# EAGLE design Meter-Daughterboard-input-v43JR (EAGLE 5.11)
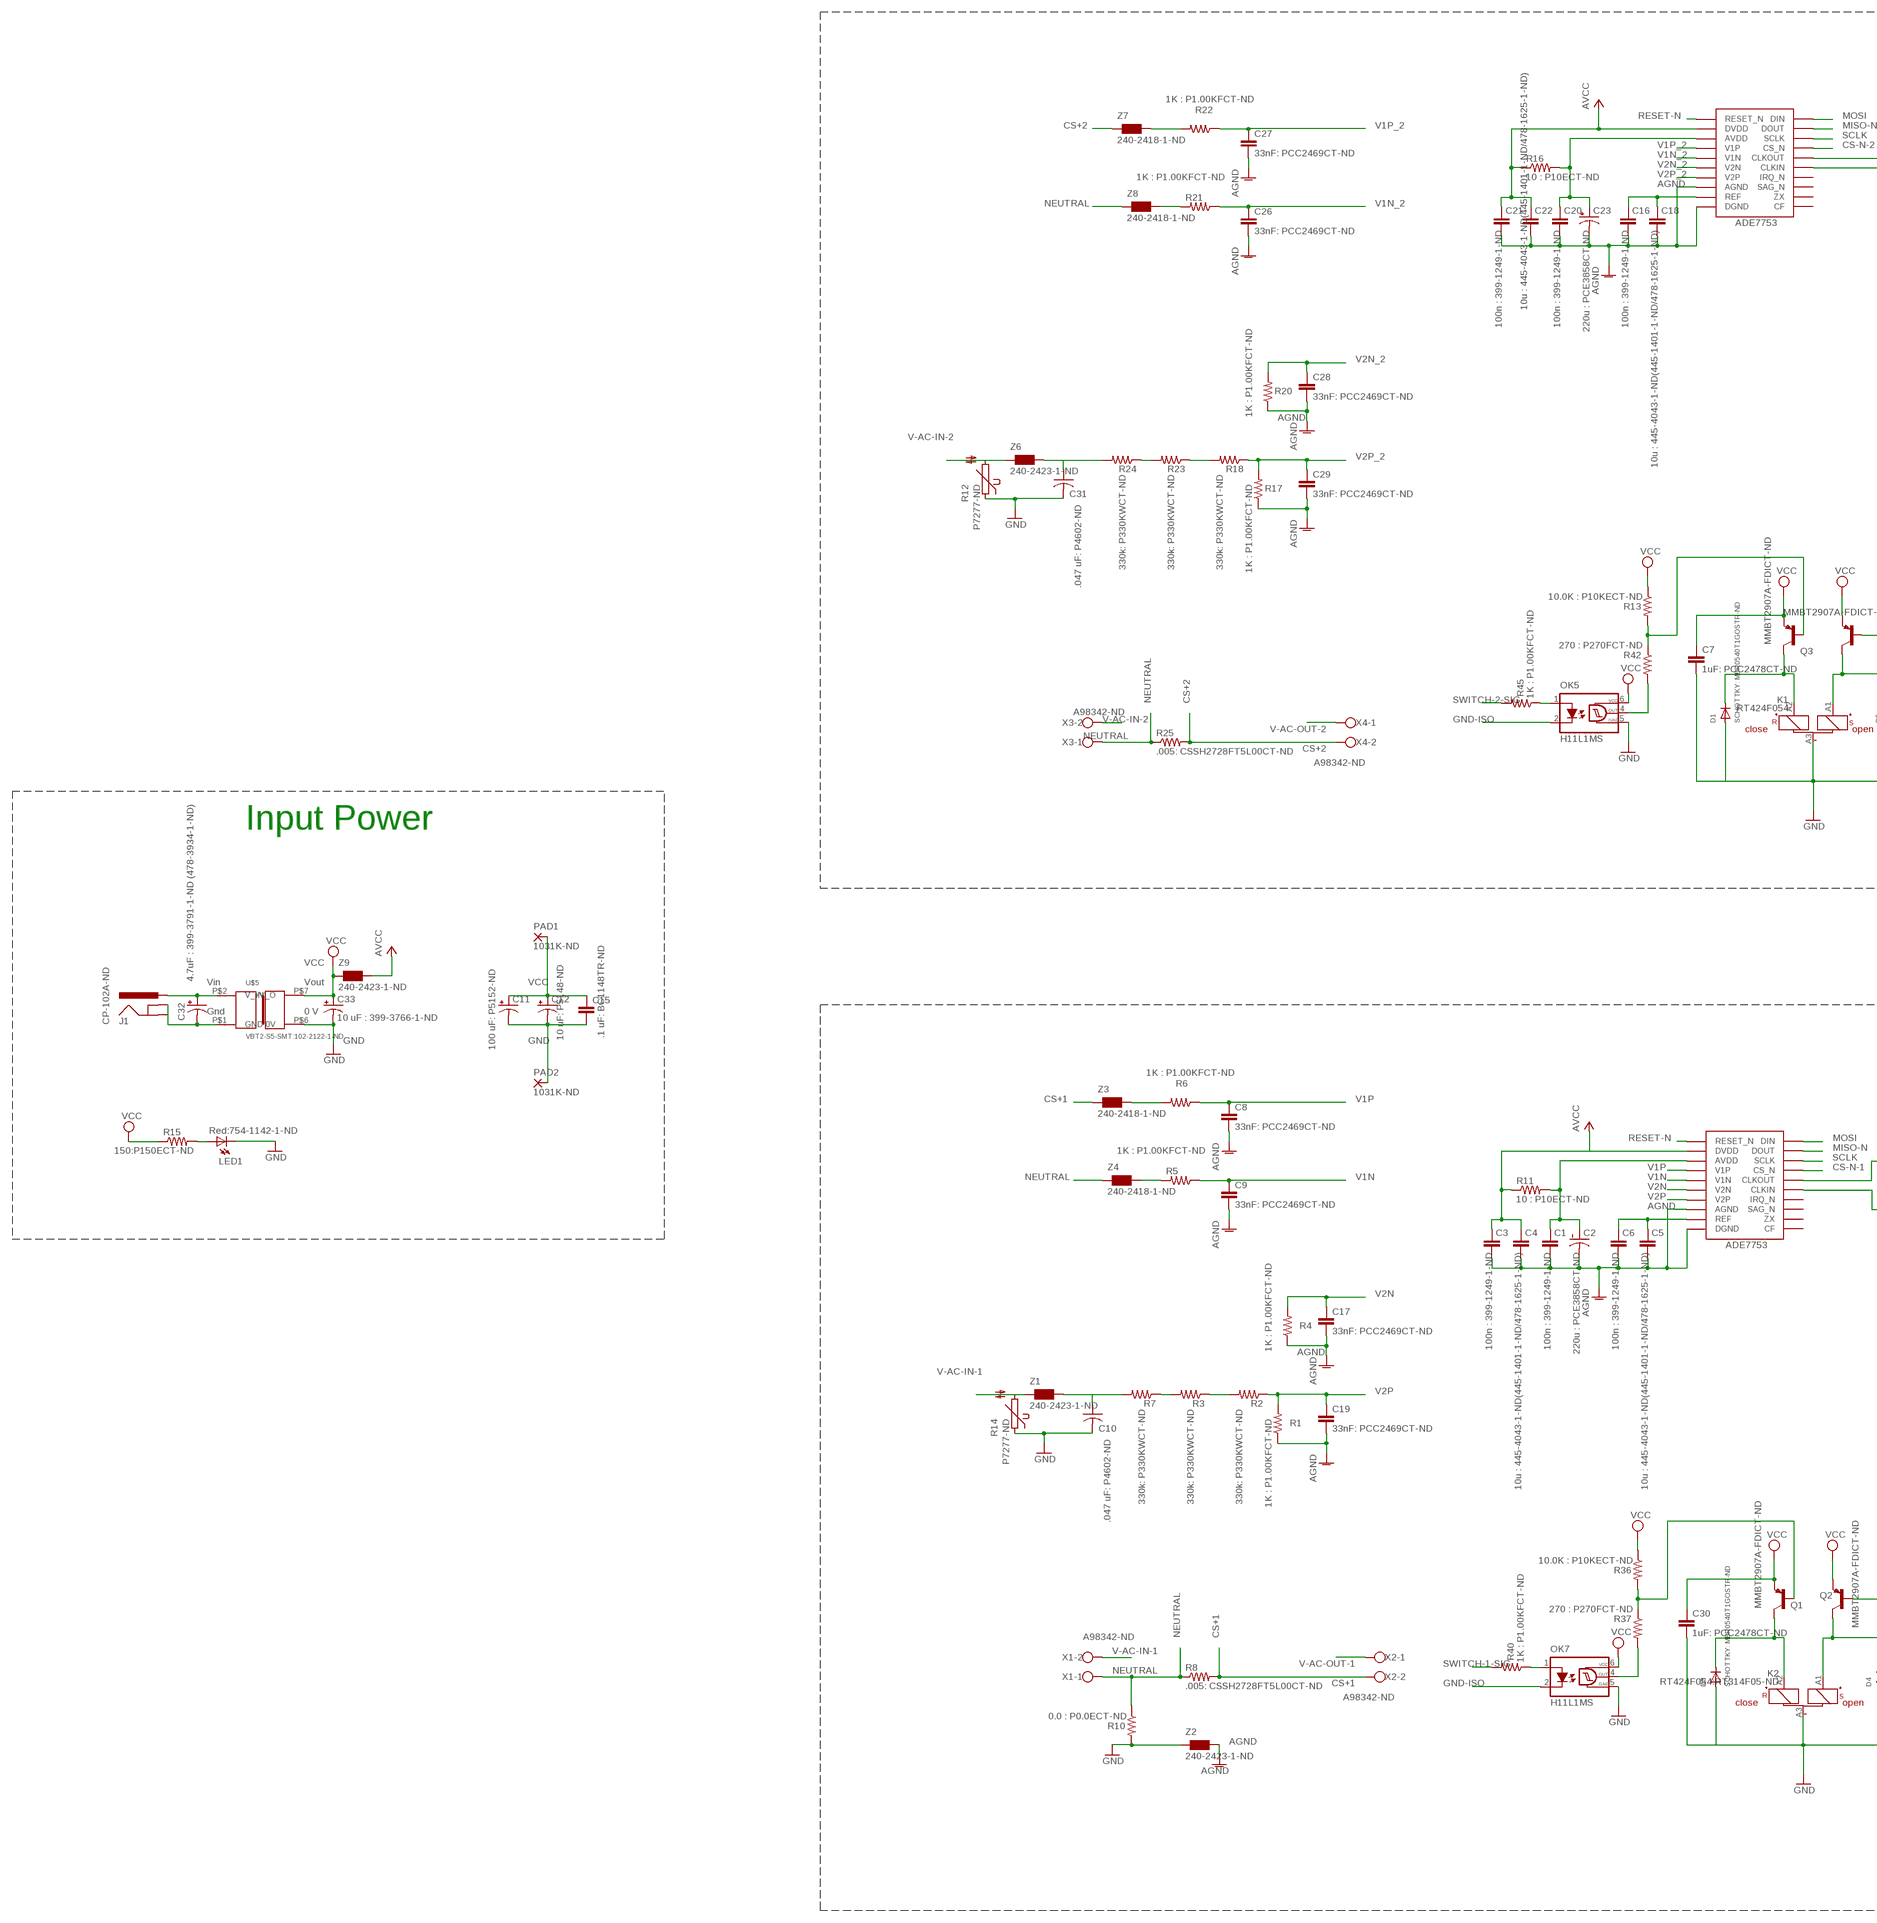
[diagram p0: schematic, sheet 1, part 1 of 2]
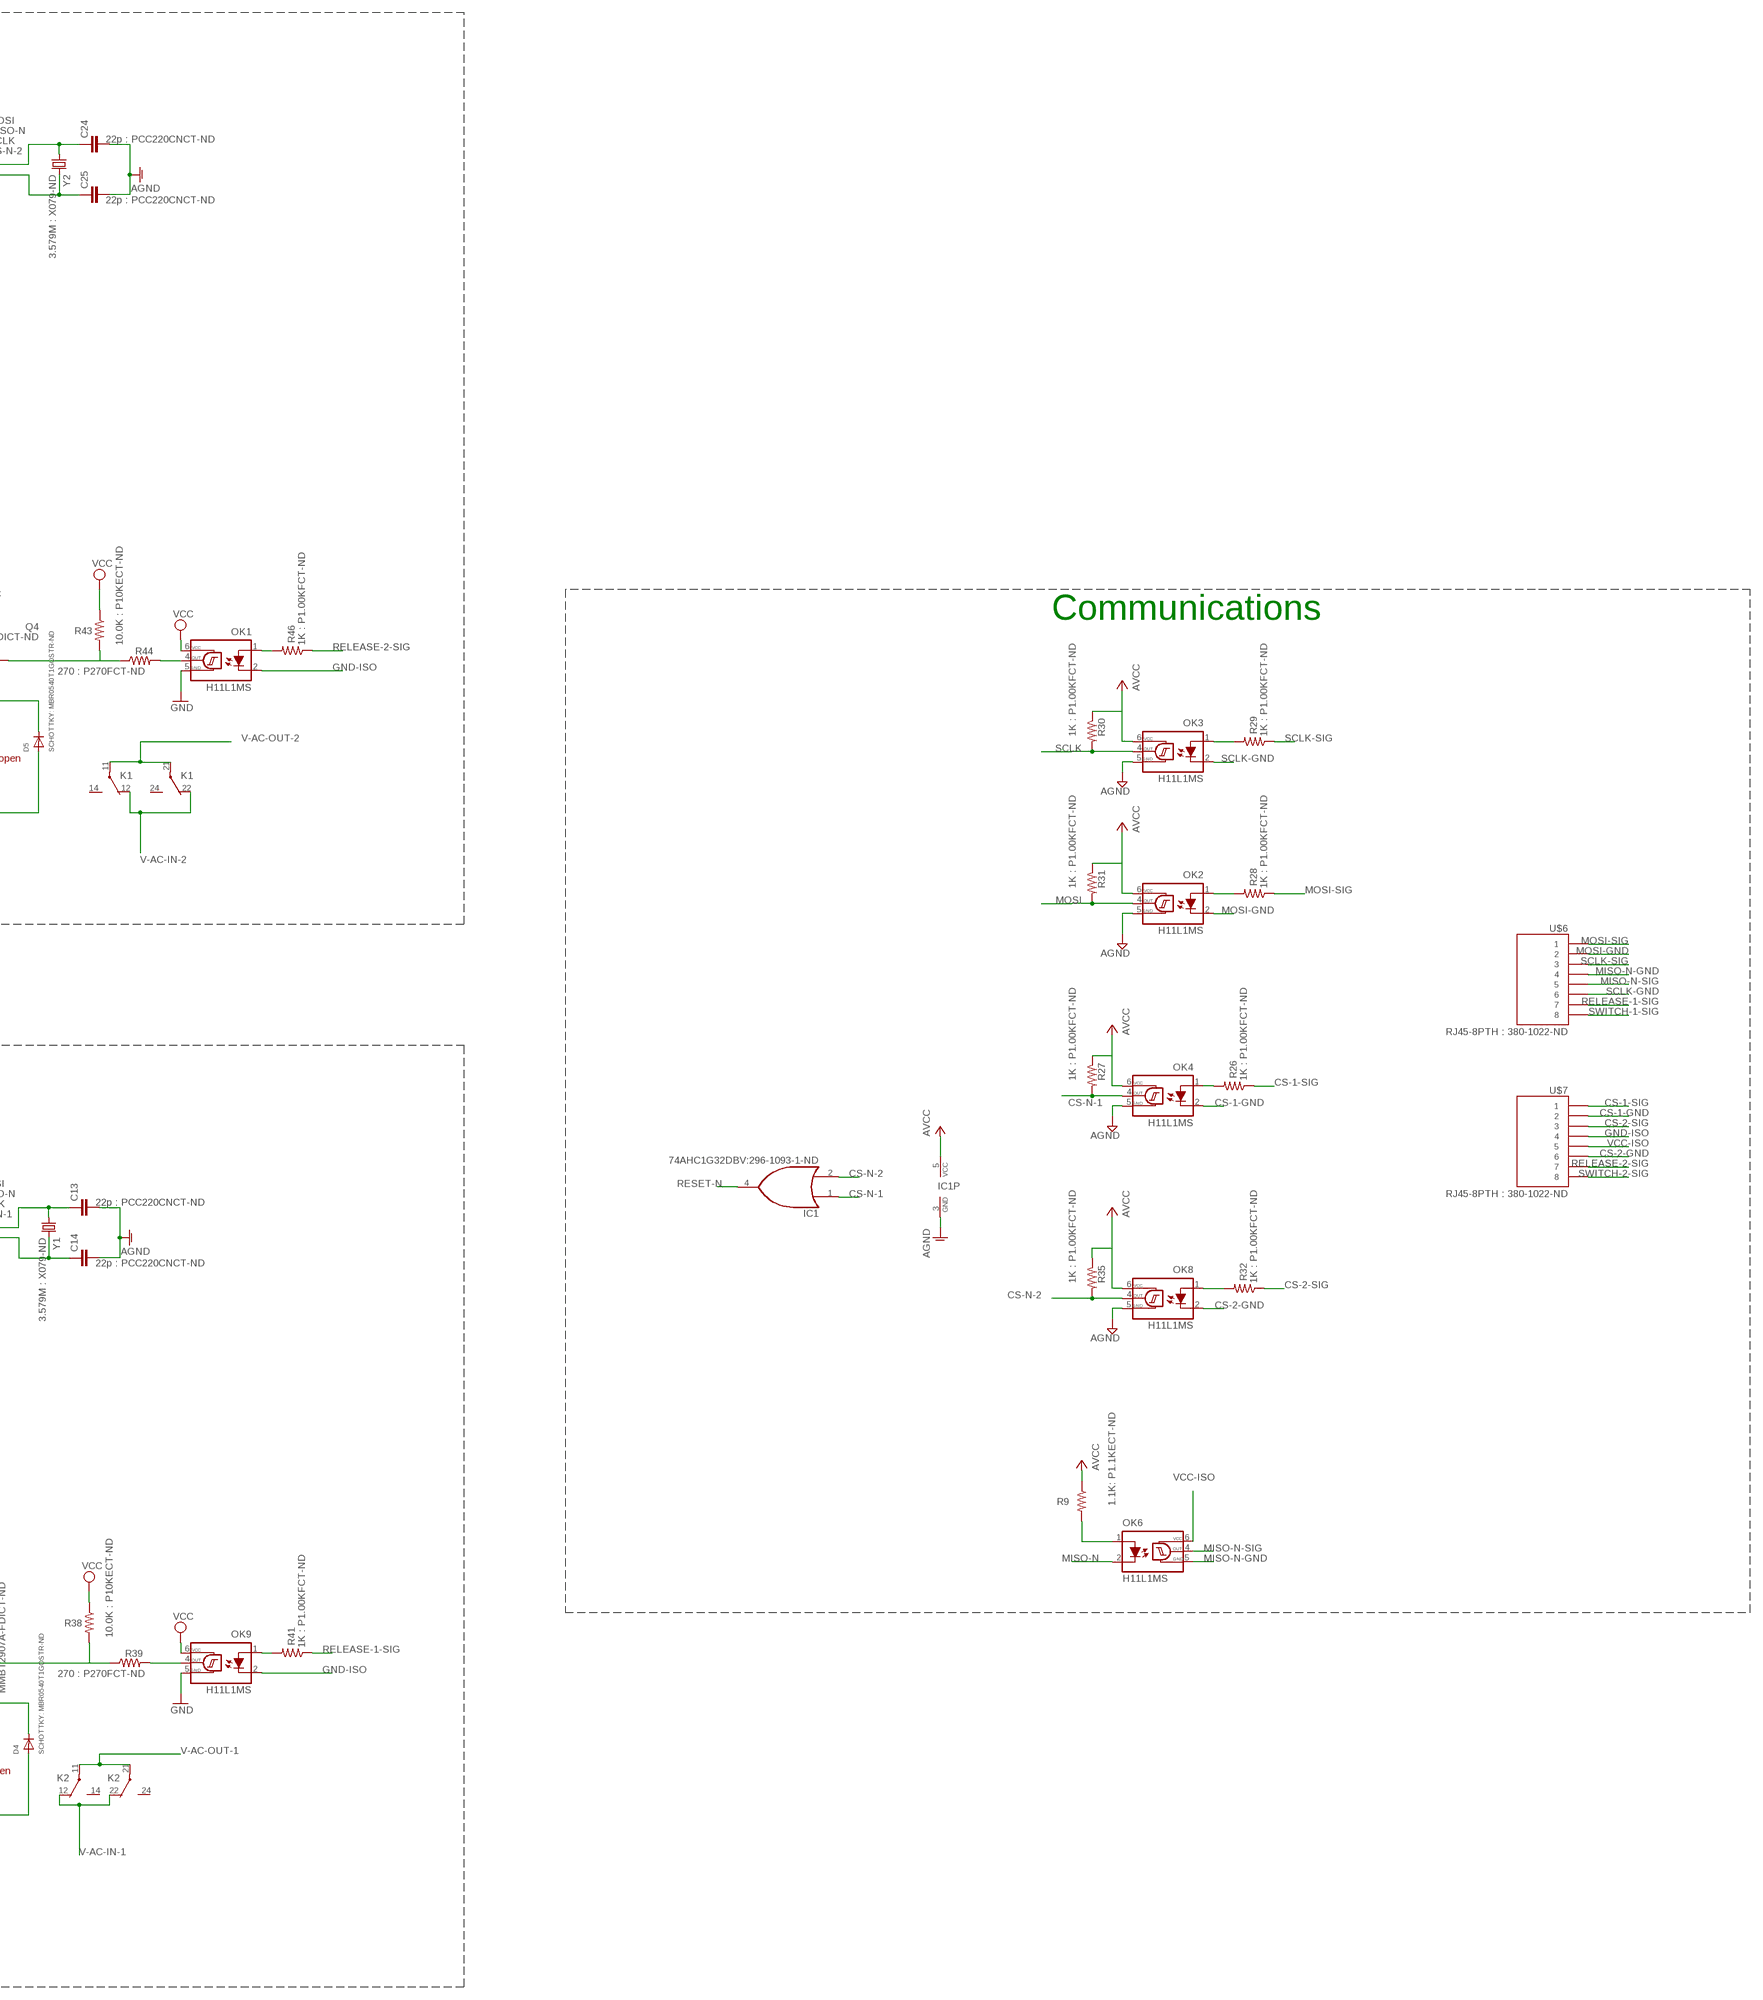
[diagram p1: schematic, sheet 1, part 2 of 2]

## Parts
ADE1  ADE7753ARSZ-ND  ADE7753  [SSOP20]
ADE2  ADE7753ARSZ-ND  ADE7753  [SSOP20]
C1  100n : 399-1249-1-ND  C-EUC1206  [C1206]
C2  220u : PCE3858CT-ND  CPOL-USD  [PANASONIC_D]
C3  100n : 399-1249-1-ND  C-EUC1206  [C1206]
C4  10u : 445-4043-1-ND(445-1401-1-ND/478-1625-1-ND)  C-EUC1206  [C1206]
C5  10u : 445-4043-1-ND(445-1401-1-ND/478-1625-1-ND)  C-EUC1206  [C1206]
C6  100n : 399-1249-1-ND  C-EUC1206  [C1206]
C7  1uF: PCC2478CT-ND  C-EUC1206  [C1206]
C8  33nF: PCC2469CT-ND  C-EUC1206  [C1206]
C9  33nF: PCC2469CT-ND  C-EUC1206  [C1206]
C10  .047 uF: P4602-ND  C-US225-062X268  [C225-062X268]
C11  100 uF: P5152-ND  CAP_POLPTH1  [CPOL-RADIAL-100UF-25V]
C12  10 uF: P5148-ND  CAP_POLPTH2  [CPOL-RADIAL-10UF-25V]
C13  22p : PCC220CNCT-ND  CAP0805  [0805]
C14  22p : PCC220CNCT-ND  CAP0805  [0805]
C15  .1 uF: BC1148TR-ND  CAPPTH  [CAP-PTH-SMALL]
C16  100n : 399-1249-1-ND  C-EUC1206  [C1206]
C17  33nF: PCC2469CT-ND  C-EUC1206  [C1206]
C18  10u : 445-4043-1-ND(445-1401-1-ND/478-1625-1-ND)  C-EUC1206  [C1206]
C19  33nF: PCC2469CT-ND  C-EUC1206  [C1206]
C20  100n : 399-1249-1-ND  C-EUC1206  [C1206]
C21  100n : 399-1249-1-ND  C-EUC1206  [C1206]
C22  10u : 445-4043-1-ND(445-1401-1-ND/478-1625-1-ND)  C-EUC1206  [C1206]
C23  220u : PCE3858CT-ND  CPOL-USD  [PANASONIC_D]
C24  22p : PCC220CNCT-ND  CAP0805  [0805]
C25  22p : PCC220CNCT-ND  CAP0805  [0805]
C26  33nF: PCC2469CT-ND  C-EUC1206  [C1206]
C27  33nF: PCC2469CT-ND  C-EUC1206  [C1206]
C28  33nF: PCC2469CT-ND  C-EUC1206  [C1206]
C29  33nF: PCC2469CT-ND  C-EUC1206  [C1206]
C30  1uF: PCC2478CT-ND  C-EUC1206  [C1206]
C31  .047 uF: P4602-ND  C-US225-062X268  [C225-062X268]
C32  4.7uF : 399-3791-1-ND (478-3934-1-ND)  CAP_POL7343  [EIA7343]
C33  10 uF : 399-3766-1-ND  CAP_POL7343  [EIA7343]
D1  SCHOTTKY: MBR0540T1GOSTR-ND  DIODESOD-123  [SOD-123]
D3  SCHOTTKY: MBR0540T1GOSTR-ND  DIODESOD-123  [SOD-123]
D4  SCHOTTKY: MBR0540T1GOSTR-ND  DIODESOD-123  [SOD-123]
D5  SCHOTTKY: MBR0540T1GOSTR-ND  DIODESOD-123  [SOD-123]
IC1  74AHC1G32DBV:296-1093-1-ND  74AHC1G32DBV  [SOT23-5]
J1  CP-102A-ND  POWER_JACKPTH  [POWER_JACK_PTH]
K1  RT424F054  [RT424]
K2  RT424F054:RT314F05-ND  RT424F054  [RT424]
LED1  Red:754-1142-1-ND  LEDCHIPLED_1206  [CHIPLED_1206]
OK1  H11L1MS  [DIL6-SMD]
OK2  H11L1MS  [DIL6-SMD]
OK3  H11L1MS  [DIL6-SMD]
OK4  H11L1MS  [DIL6-SMD]
OK5  H11L1MS  [DIL6-SMD]
OK6  H11L1MS  [DIL6-SMD]
OK7  H11L1MS  [DIL6-SMD]
OK8  H11L1MS  [DIL6-SMD]
OK9  H11L1MS  [DIL6-SMD]
PAD1  1031K-ND  2,54/0,9  [2,54/0,9]
PAD2  1031K-ND  2,54/0,9  [2,54/0,9]
Q1  MMBT2907A-FDICT-ND  MMBT2907ALT1-PNP-SOT23-BEC  [SOT23-BEC]
Q2  MMBT2907A-FDICT-ND  MMBT2907ALT1-PNP-SOT23-BEC  [SOT23-BEC]
Q3  MMBT2907A-FDICT-ND  MMBT2907ALT1-PNP-SOT23-BEC  [SOT23-BEC]
Q4  MMBT2907A-FDICT-ND  MMBT2907ALT1-PNP-SOT23-BEC  [SOT23-BEC]
R1  1K : P1.00KFCT-ND  RESISTOR1206  [1206]
R2  330k: P330KWCT-ND  R-US_R2010  [R2010]
R3  330k: P330KWCT-ND  R-US_R2010  [R2010]
R4  1K : P1.00KFCT-ND  RESISTOR1206  [1206]
R5  1K : P1.00KFCT-ND  RESISTOR1206  [1206]
R6  1K : P1.00KFCT-ND  RESISTOR1206  [1206]
R7  330k: P330KWCT-ND  R-US_R2010  [R2010]
R8  .005: CSSH2728FT5L00CT-ND  RESISTOR2728  [SMD-2728]
R9  1.1K: P1.1KECT-ND  RESISTOR1206  [1206]
R10  0.0 : P0.0ECT-ND  RESISTOR1206  [1206]
R11  10 : P10ECT-ND  R-US_R1206  [R1206]
R12  P7277-ND  S20K250  [S20K250]
R13  10.0K : P10KECT-ND  RESISTOR1206  [1206]
R14  P7277-ND  S20K250  [S20K250]
R15  150:P150ECT-ND  R-US_R1206  [R1206]
R16  10 : P10ECT-ND  R-US_R1206  [R1206]
R17  1K : P1.00KFCT-ND  RESISTOR1206  [1206]
R18  330k: P330KWCT-ND  R-US_R2010  [R2010]
R20  1K : P1.00KFCT-ND  RESISTOR1206  [1206]
R21  1K : P1.00KFCT-ND  RESISTOR1206  [1206]
R22  1K : P1.00KFCT-ND  RESISTOR1206  [1206]
R23  330k: P330KWCT-ND  R-US_R2010  [R2010]
R24  330k: P330KWCT-ND  R-US_R2010  [R2010]
R25  .005: CSSH2728FT5L00CT-ND  RESISTOR2728  [SMD-2728]
R26  1K : P1.00KFCT-ND  RESISTOR1206  [1206]
R27  1K : P1.00KFCT-ND  RESISTOR1206  [1206]
R28  1K : P1.00KFCT-ND  RESISTOR1206  [1206]
R29  1K : P1.00KFCT-ND  RESISTOR1206  [1206]
R30  1K : P1.00KFCT-ND  RESISTOR1206  [1206]
R31  1K : P1.00KFCT-ND  RESISTOR1206  [1206]
R32  1K : P1.00KFCT-ND  RESISTOR1206  [1206]
R35  1K : P1.00KFCT-ND  RESISTOR1206  [1206]
R36  10.0K : P10KECT-ND  RESISTOR1206  [1206]
R37  270 : P270FCT-ND  RESISTOR1206  [1206]
R38  10.0K : P10KECT-ND  RESISTOR1206  [1206]
R39  270 : P270FCT-ND  RESISTOR1206  [1206]
R40  1K : P1.00KFCT-ND  RESISTOR1206  [1206]
R41  1K : P1.00KFCT-ND  RESISTOR1206  [1206]
R42  270 : P270FCT-ND  RESISTOR1206  [1206]
R43  10.0K : P10KECT-ND  RESISTOR1206  [1206]
R44  270 : P270FCT-ND  RESISTOR1206  [1206]
R45  1K : P1.00KFCT-ND  RESISTOR1206  [1206]
R46  1K : P1.00KFCT-ND  RESISTOR1206  [1206]
U$5  VBT2-S5-SMT:102-2122-1-ND  VBT2-S5-SMT  [DIP-14-SMD]
U$6  RJ45-8PTH : 380-1022-ND  RJ45-8PTH  [RJ45-8]
U$7  RJ45-8PTH : 380-1022-ND  RJ45-8PTH  [RJ45-8]
X1  A98342-ND  W237-102  [W237-102]
X2  A98342-ND  W237-102  [W237-102]
X3  A98342-ND  W237-102  [W237-102]
X4  A98342-ND  W237-102  [W237-102]
Y1  3.579M : X079-ND  CRYSTALHC49S  [HC49/S]
Y2  3.579M : X079-ND  CRYSTALHC49S  [HC49/S]
Z1  240-2423-1-ND  WE-CBF_1812  [1812]
Z2  240-2423-1-ND  WE-CBF_1812  [1812]
Z3  240-2418-1-ND  WE-CBF_1806  [1806]
Z4  240-2418-1-ND  WE-CBF_1806  [1806]
Z6  240-2423-1-ND  WE-CBF_1812  [1812]
Z7  240-2418-1-ND  WE-CBF_1806  [1806]
Z8  240-2418-1-ND  WE-CBF_1806  [1806]
Z9  240-2423-1-ND  WE-CBF_1812  [1812]

## Nets
AGND: ADE1.8(AGND) ADE1.10(DGND) ADE2.8(AGND) ADE2.10(DGND) C1.2 C2.- C3.2 C4.2 C5.2 C6.2 C8.2 C9.2 C13.2 C14.2 C16.2 C17.2 C18.2 C19.2 C20.2 C21.2 C22.2 C23.- C24.2 C25.2 C26.2 C27.2 C28.2 C29.2 IC1.3(GND) OK2.5(GND) OK3.5(GND) OK4.5(GND) OK8.5(GND) R1.1 R4.1 R17.1 R20.1 Z2.2
AVCC: ADE1.2(DVDD) ADE2.2(DVDD) C3.1 C4.1 C21.1 C22.1 IC1.5(VCC) OK2.6(VCC) OK3.6(VCC) OK4.6(VCC) OK8.6(VCC) R9.1 R11.1 R16.1 R27.1 R30.1 R31.1 R35.1 Z9.2
AVDD: ADE1.3(AVDD) C1.1 C2.+ R11.2
AVDD1: ADE2.3(AVDD) C20.1 C23.+ R16.2
CS+1 [NEUTRAL AC Line]: R8.2 X2.2 Z3.1
CS+2 [NEUTRAL AC Line]: R25.2 X4.2 Z7.1
CS-1-GND: OK4.2(C) U$7.2
CS-1-SIG: R26.1 U$7.1
CS-2-GND: OK8.2(C) U$7.6
CS-2-SIG: R32.1 U$7.3
CS-N-1: ADE1.17(CS_N) IC1.1(I0) OK4.4(OUT) R27.2
CS-N-2: ADE2.17(CS_N) IC1.2(I1) OK8.4(OUT) R35.2
GND: C7.2 C10.2 C11.2(-) C12.2(-) C15.2 C30.2 C31.2 C33.C(-) D1.A D3.A D4.A D5.A K1.A3(1:-) K2.A3(1:-) LED1.C OK1.5(GND) OK5.5(GND) OK7.5(GND) OK9.5(GND) PAD2.1(P) R10.2 R12.1 R14.1 U$5.P$6(0V) Z2.1
GND-ISO: OK1.2(C) OK5.2(C) OK7.2(C) OK9.2(C) U$7.4
INPUT_GND [INPUT Power]: C32.C(-) J1.GND J1.GNDBREAK U$5.P$1(GND)
INPUT_VCC [INPUT Power]: C32.A(+) J1.PWR U$5.P$2(V_IN)
MISO-N: ADE1.19(DOUT) ADE2.19(DOUT) OK6.2(C)
MISO-N-GND: OK6.5(GND) U$6.4
MISO-N-SIG: OK6.4(OUT) U$6.5
MOSI: ADE1.20(DIN) ADE2.20(DIN) OK2.4(OUT) R31.2
MOSI-GND: OK2.2(C) U$6.2
MOSI-SIG: R28.1 U$6.1
N$1 [NEUTRAL AC Line]: R6.2 Z3.2
N$2 [HOT AC Line]: C10.1 R7.2 Z1.2
N$3 [NEUTRAL AC Line]: R5.2 Z4.2
N$4 [HOT AC Line]: C31.1 R24.2 Z6.2
N$5 [HOT AC Line]: R3.2 R7.1
N$6 [HOT AC Line]: R2.2 R3.1
N$7: OK7.4(OUT) R37.2
N$8: D5.C K1.A1(1:S+) Q4.C
N$9: ADE2.16(CLKOUT) C24.1 Y2.1
N$10: ADE1.16(CLKOUT) C13.1 Y1.1
N$11: ADE1.15(CLKIN) C14.1 Y1.2
N$12: ADE2.15(CLKIN) C25.1 Y2.2
N$13 [NEUTRAL AC Line]: R22.2 Z7.2
N$14 [NEUTRAL AC Line]: R21.2 Z8.2
N$15 [HOT AC Line]: R23.2 R24.1
N$16 [HOT AC Line]: R18.2 R23.1
N$17: D4.C K2.A1(1:S+) Q2.C
N$18: D3.C K2.A2(1:R+) Q1.C
N$19: OK2.1(A) R28.2
N$20: OK6.1(A) R9.2
N$21: OK9.4(OUT) R39.2
N$22: Q1.B R36.2 R37.1
N$23: D1.C K1.A2(1:R+) Q3.C
N$24: Q2.B R38.2 R39.1
N$25: Q3.B R13.2 R42.1
N$26: OK7.1(A) R40.1
N$27: Q4.B R43.2 R44.1
N$28: OK5.4(OUT) R42.2
N$29: OK9.1(A) R41.2
N$30: OK1.4(OUT) R44.2
N$31: OK5.1(A) R45.1
N$32: OK1.1(A) R46.2
N$33: OK3.1(A) R29.2
N$34: OK8.1(A) R32.2
N$35: OK4.1(A) R26.2
N$36: LED1.A R15.2
NEUTRAL [NEUTRAL AC Line]: R8.1 R10.1 R25.1 X1.1 X3.1 Z4.1 Z8.1
REF: ADE1.9(REF) C5.1 C6.1
REF1: ADE2.9(REF) C16.1 C18.1
RELEASE-1-SIG: R41.1 U$6.7
RELEASE-2-SIG: R46.1 U$7.7
RESET-N: ADE1.1(RESET_N) ADE2.1(RESET_N) IC1.4(O)
SCLK: ADE1.18(SCLK) ADE2.18(SCLK) OK3.4(OUT) R30.2
SCLK-GND: OK3.2(C) U$6.6
SCLK-SIG: R29.1 U$6.3
SWITCH-1-SIG: R40.2 U$6.8
SWITCH-2-SIG: R45.2 U$7.8
V1N: ADE1.5(V1N) C9.1 R5.1
V1N_2: ADE2.5(V1N) C26.1 R21.1
V1P: ADE1.4(V1P) C8.1 R6.1
V1P_2: ADE2.4(V1P) C27.1 R22.1
V2N: ADE1.6(V2N) C17.1 R4.2
V2N_2: ADE2.6(V2N) C28.1 R20.2
V2P: ADE1.7(V2P) C19.1 R1.2 R2.1
V2P_2: ADE2.7(V2P) C29.1 R17.2 R18.1
V-AC-IN-1 [HOT AC Line]: K2.12(2:O) K2.22(3:O) R14.2 X1.2 Z1.1
V-AC-IN-2 [HOT AC Line]: K1.12(2:O) K1.22(3:O) R12.2 X3.2 Z6.1
V-AC-OUT-1 [HOT AC Line]: K2.11(2:P) K2.21(3:P) X2.1
V-AC-OUT-2 [HOT AC Line]: K1.11(2:P) K1.21(3:P) X4.1
VCC: C7.1 C11.1(+) C12.1(+) C15.1 C30.1 C33.A(+) OK1.6(VCC) OK5.6(VCC) OK7.6(VCC) OK9.6(VCC) PAD1.1(P) Q1.E Q2.E Q3.E Q4.E R13.1 R15.1 R36.1 R38.1 R43.1 U$5.P$7(+V_O) Z9.1
VCC-ISO: OK6.6(VCC) U$7.5
Unconnected: ADE1.11(CF) ADE1.12(ZX) ADE1.13(SAG_N) ADE1.14(IRQ_N) ADE2.11(CF) ADE2.12(ZX) ADE2.13(SAG_N) ADE2.14(IRQ_N) K1.14(2:S) K1.24(3:S) K2.14(2:S) K2.24(3:S)

## Notes on the sheet
- Communications
- close | open
- Input Power
- close | open

## Library data of the parts
ADE1 ADE2 = ACMeterEagle:ADE7753
C1 C3-C9 C16-C22 C26-C30 = rcl:C-EU: CAPACITOR, European symbol
C2 C23 = rcl:CPOL-US: POLARIZED CAPACITOR, American symbol
C10 C31 = adafruit:C-US: CAPACITOR, American symbol
C11 C12 C32 C33 = SparkFun:CAP_POL: Capacitor Polarized These are standard SMD and PTH capacitors. Normally 10uF, 47uF, and 100uF in electrolytic and tantalum varieties. Always verify the external diameter of the through hole cap, it varies with capacity, voltage, and manufacturer. The EIA devices should be standard.
C13 C14 C24 C25 = SparkFunEagle-6-6-07:CAP: Capacitor Standard 0603 ceramic capacitor, and 0.1" leaded capacitor.
C15 = SparkFun:CAP: Capacitor Standard 0603 ceramic capacitor, and 0.1" leaded capacitor.
D1 D3-D5 = adafruit:DIODE: Diode SMADIODE - SMA Surface Mount Package 20V 1A Schottky Diode Digikey: 641-1014-6-ND DO-1N4148 - Through Hole Small Current Diode SOD-123 20V 1 A (.5mV Vf) Schottky Diode - Digikey: MBRX120TPMSCT-ND SOD-323 10V 570mA (.38mV Vf, 3ns) Schottky Diode - Digikey: ZLLS410CT-ND SOD-523 30V 30mA Schottky Diode (RB751S-40TE61) - Digikey: RB751S-40TE61CT-ND SOT23-R/W - SOT23 Package (R = Solder Paste/Reflow Ovens, W = Hand-Soldering) BAT54Film 40V 300mA - Digikey: 497-7162-1-ND
IC1 = 74xx-little-us:74*1G32: 2-input OR gate
J1 = SparkFun:POWER_JACK: Power Jack This is the standard 5.5mm barrel jack for power. The PTH is the most common, proven, reliable, footprint. All others are experimental. The Slot footprint only works if the mill layer is transmitted to the PCB fab house so be warned. Spark Fun Electronics SKU : PRT-00119. Mating wall wart : TOL-00298 (and others)
K1 K2 = relay:RT424F*: Power PCB Relay polarized bistable version SCHRACK 2 pole 8 A Source: http://www.schrack.com/.. 5843.pdf; OC_FARNELL: unknown; OC_NEWARK: unknown
LED1 = adafruit:LED: LED OSRAM: - CHIPLED LG R971, LG N971, LY N971, LG Q971, LY Q971, LO R971, LY R971 LH N974, LH R974 LS Q976, LO Q976, LY Q976 LO Q996 - Hyper CHIPLED LW Q18S LB Q993, LB Q99A, LB R99A - SideLED LS A670, LO A670, LY A670, LG A670, LP A670 LB A673, LV A673, LT A673, LW A673 LH A674 LY A675 LS A676, LA A676, LO A676, LY A676, LW A676 LS A679, LY A679, LG A679 - Hyper Micro SIDELED® LS Y876, LA Y876, LO Y876, LY Y876 LT Y87S - SmartLED LW L88C, LW L88S LB L89C, LB L89S, LG L890 LS L89K, LO L89K, LY L89K LS L896, LA L896, LO L896, LY L896 - TOPLED LS T670, LO T670, LY T670, LG T670, LP T670 LSG T670, LSP T670, LSY T670, LOP T670, LYG T670 LG T671, LOG T671, LSG T671 LB T673, LV T673, LT T673, LW T673 LH T674 LS T676, LA T676, LO T676, LY T676, LB T676, LH T676, LSB T676, LW T676 LB T67C, LV T67C, LT T67C, LS T67K, LO T67K, LY T67K, LW E67C LS E67B, LA E67B, LO E67B, LY E67B, LB E67C, LV E67C, LT E67C LW T67C LS T679, LY T679, LG T679 LS T770, LO T770, LY T770, LG T770, LP T770 LB T773, LV T773, LT T773, LW T773 LH T774 LS E675, LA E675, LY E675, LS T675 LS T776, LA T776, LO T776, LY T776, LB T776 LHGB T686 LT T68C, LB T68C - Hyper Mini TOPLED® LB M676 - Mini TOPLED Santana® LG M470 LS M47K, LO M47K, LY M47K Source: http://www.osram.convergy.de/
OK1-OK9 = optocoupler:H11L*M: 6-Pin DIP Optocoupler Source: http://www.fairchildsemi.com/ds/H1/H11L2-M.pdf; OC_FARNELL: unknown; OC_NEWARK: unknown
PAD1 PAD2 = wirepad:2,54/0,9: THROUGH-HOLE PAD
Q1-Q4 = transistor:*-PNP-: PNP Transistror
R1 R4-R6 R8-R10 R13 R17 R20-R22 R25-R32 R35-R46 = SparkFun:RESISTOR: Resistor Basic schematic elements and footprints for 0603, 1206, and PTH 1/10th watt (small) resistors.
R2 R3 R7 R15 R18 R23 R24 = adafruit:R-US_: RESISTOR, American symbol
R11 R16 = rcl:R-US_: RESISTOR, American symbol
R12 R14 = varistor:S20K250: VARISTOR
U$5 = dc-dc_iso_conv:VBT2-S5-SMT: CUI 5v-5v DC-DC Isolation Converter Part number: VBT2-S5-S5-SMT Digikey number: 102-2122-1-ND
U$6 U$7 = SparkFun:RJ45-8: RJ45 Jack Simple RJ45, 8-pin connection - connector for common Cat5, Cat5e, and Cat6 Ethernet cables. Footprint not yet proven in production. Connector sku is PRT-00643; Breakout PCB sku is BOB-00716.
X1-X4 = con-wago-500:W237-102: WAGO SCREW CLAMP
Y1 Y2 = crystal:CRYSTAL: CRYSTAL
Z1-Z4 Z6-Z9 = wuerth-elektronik:WE-CBF: SMD EMI Suppression Ferrite Beads - excellent anti-EMI properties - low DCR - impedances till 3000 ohms - rated current up to 6 A

## Net classes
1 HOT AC Line: width 1.905 mm, drill 0.508 mm, clearance 2.54 mm
2 NEUTRAL AC Line: width 1.905 mm, drill 0.508 mm, clearance 0.508 mm
3 INPUT Power: width 0.61 mm, drill 0.33 mm, clearance 1.27 mm

## Board
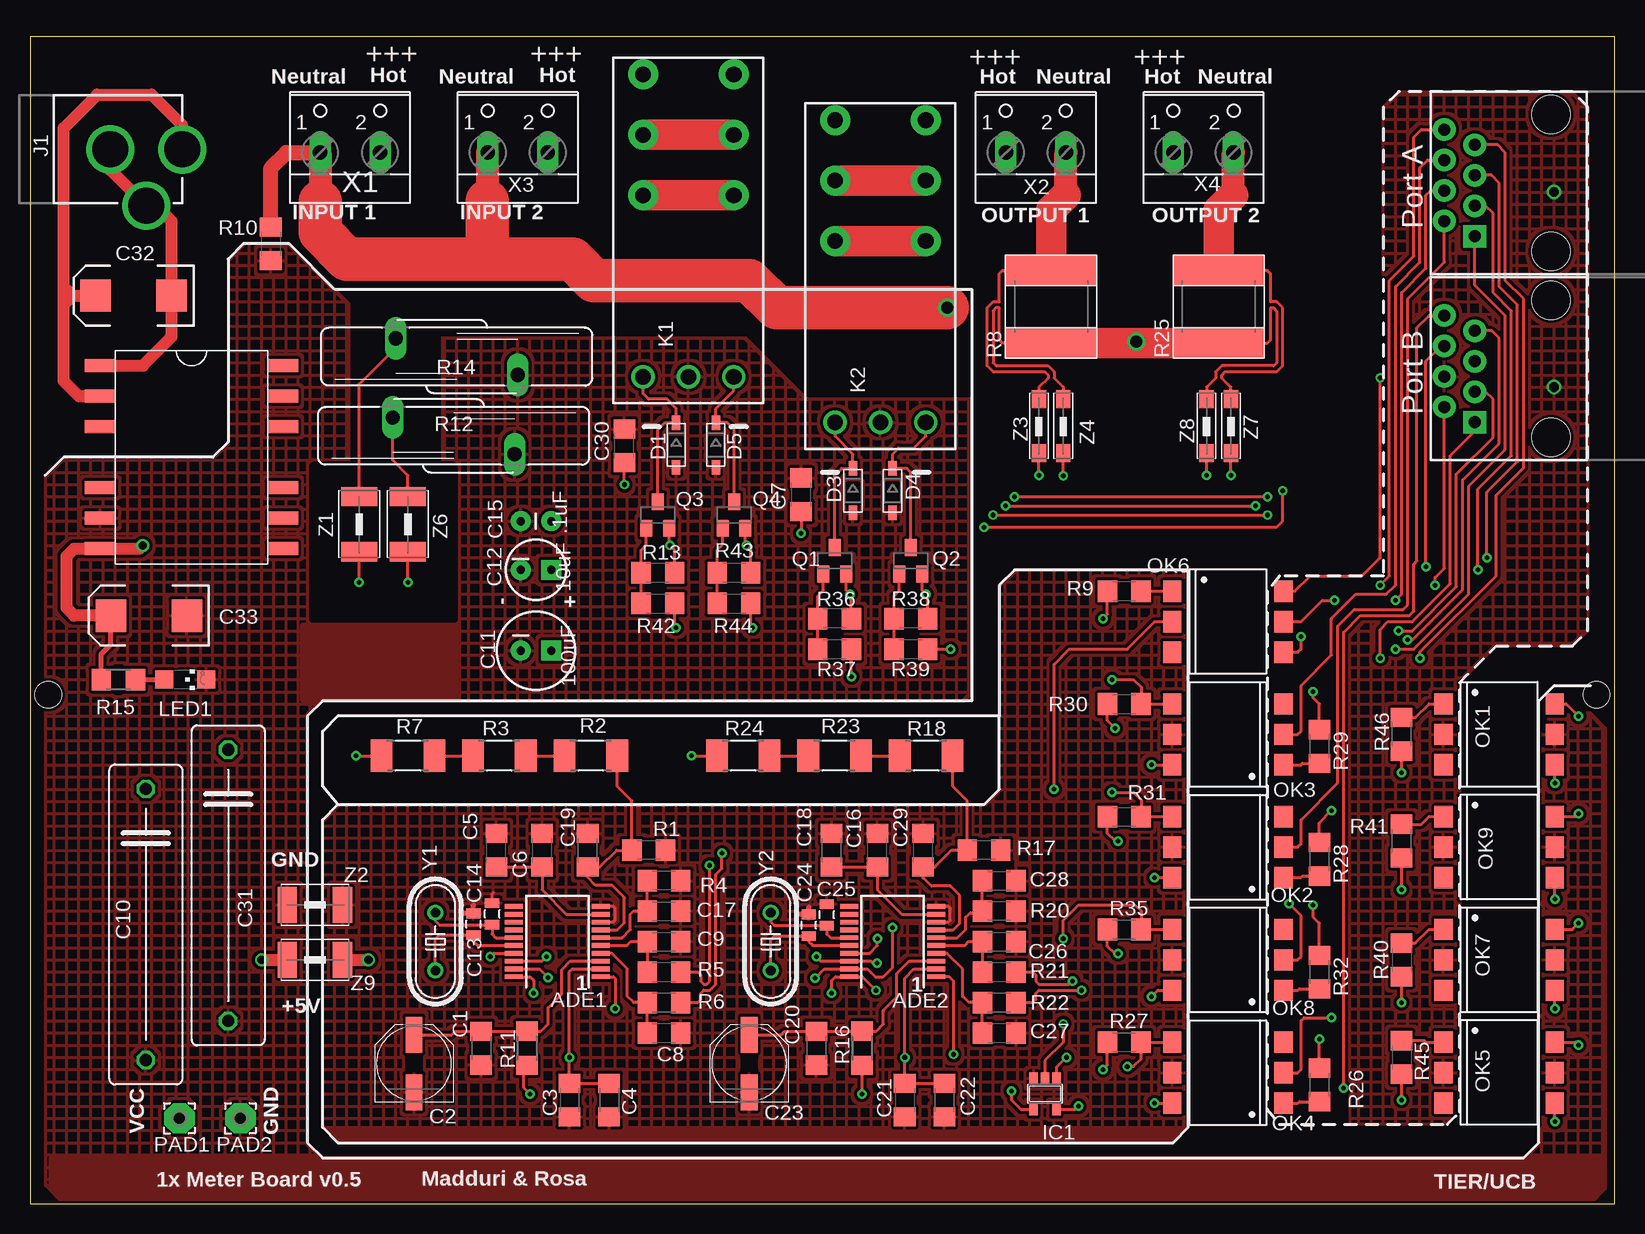
[diagram p2: board, top side]
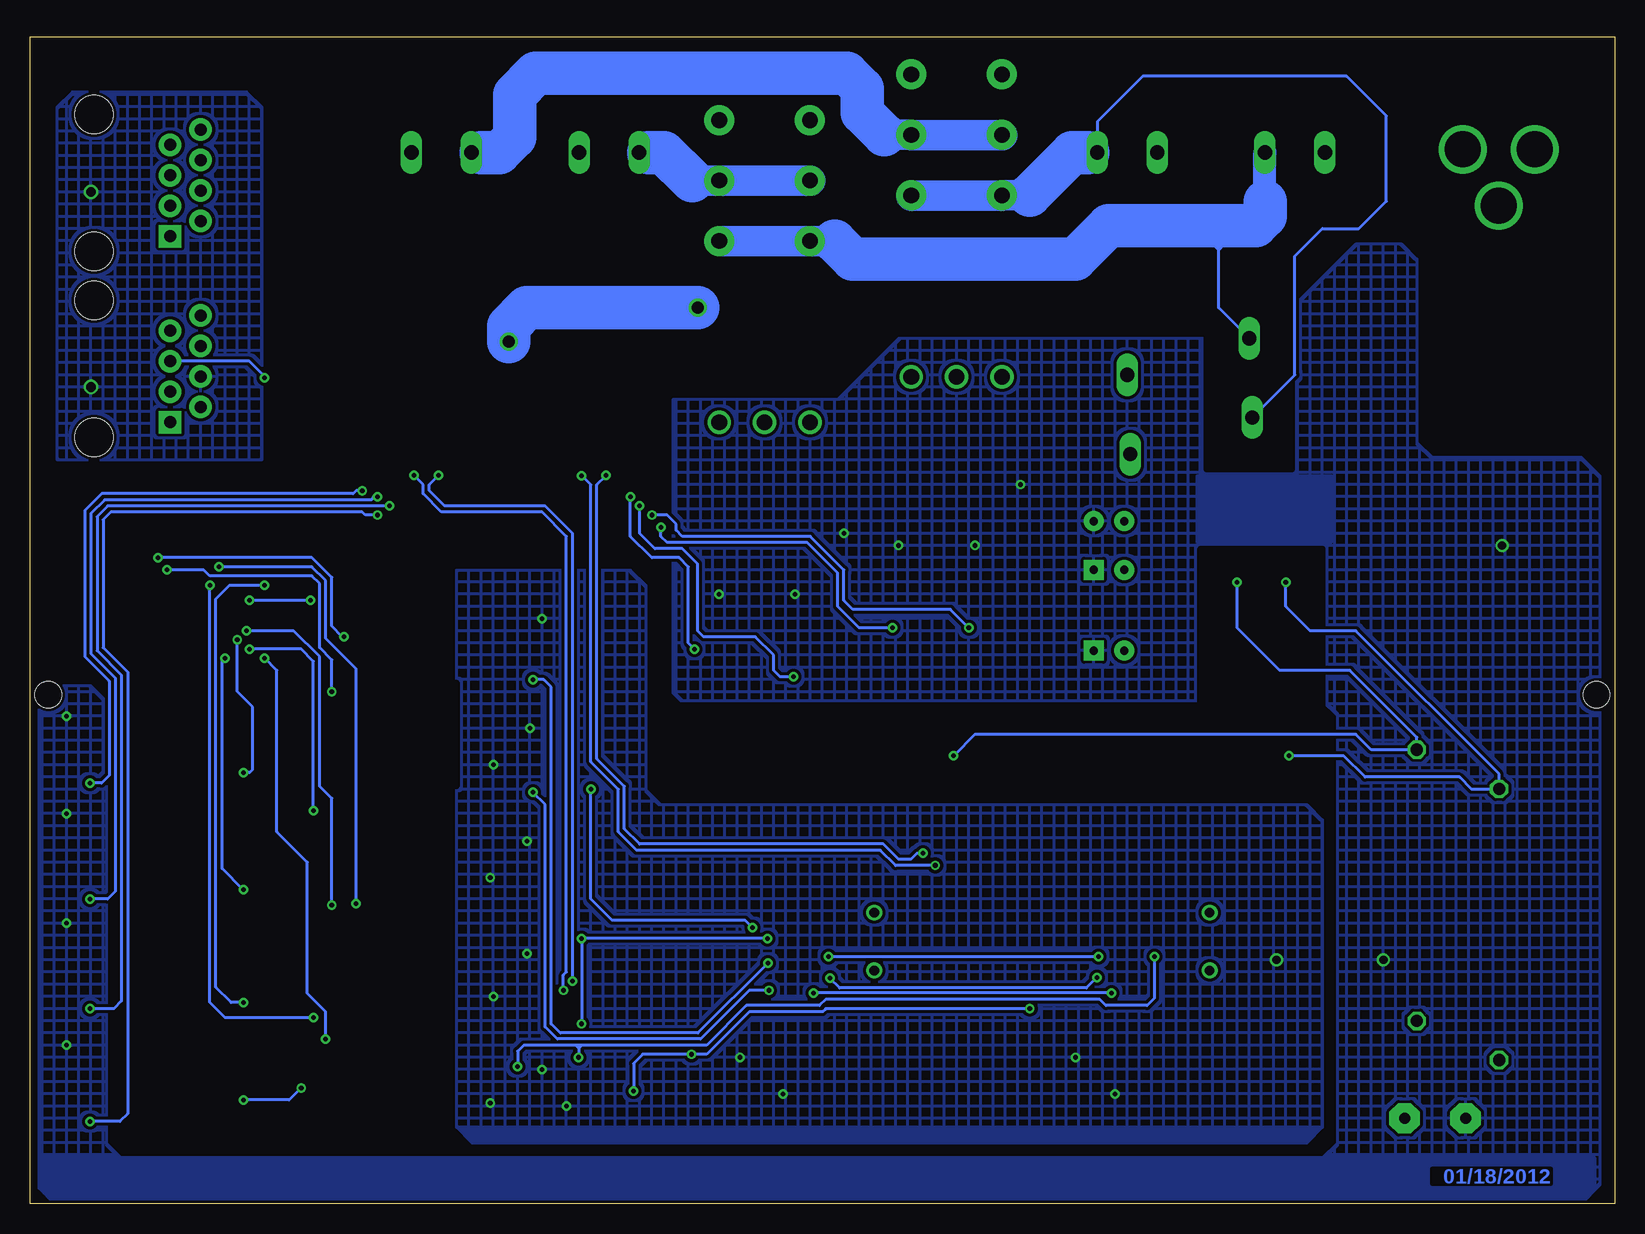
[diagram p3: board, bottom side, seen from below]

Size 132.08 x 97.28 mm. Coordinates in mm from the lower left corner, seen from the top.
Outline: 0,0 132.08,0 132.08,97.28 0,97.28 0,0
Copper layers (1*16): Top 0.035mm / dielectric 1.5mm / Bottom 0.035mm
Design rules "4pcb_2layer": minimum track width 7mil, minimum drill 15mil, track to track 7mil, track to pad 7mil, pad to pad 7mil, via to via 7mil, smd to smd 7mil, copper to edge 10mil, drill to drill 7mil, minimum pad ring 10mil, minimum via ring 8mil, stop-mask expansion 4mil, vias tented up to drill 0mil, thermal gap 10mil
Holes 2.2 mm at 1.52,42.42 130.56,42.42
tRestrict: area 12.4,42.9 to 13.5,44.5; area 7.1,42.7 to 7.6,44.7; area 72.9,47.8 to 73.9,49.8; area 66.5,47.8 to 67.6,49.8; area 66.5,45.2 to 67.6,47.2; area 72.9,45.2 to 73.9,47.2; area 58.2,49 to 59.2,51.1; area 58.2,51.6 to 59.2,53.6; area 51.8,51.6 to 52.8,53.6; area 51.8,49 to 52.8,51.1; area 72.1,53.3 to 74.7,53.8; area 68.1,58.4 to 69.1,59.9; 63 more areas
bRestrict: area 26.9,61.2 to 34,76.5; area 24.4,41.7 to 34.5,54.6; area 96.5,34.8 to 103.1,43.4

### Footprints (pad centres in the part's own frame; a part is rotated, then mirrored left to right if it is on the bottom)
SSOP20 = smd 0.4 x 1.5: 1 -2.925,-3.625; 2 -2.275,-3.625; 3 -1.625,-3.625; 4 -0.975,-3.625; 5 -0.325,-3.625; 6 0.325,-3.625; 7 0.975,-3.625; 8 1.625,-3.625; 9 2.275,-3.625; 10 2.925,-3.625; 11 2.925,3.625; 12 2.275,3.625; 13 1.625,3.625; 14 0.975,3.625; 15 0.325,3.625; 16 -0.325,3.625; 17 -0.975,3.625; 18 -1.625,3.625; 19 -2.275,3.625; 20 -2.925,3.625
C1206 = smd 1.6 x 1.8: 1 -1.4,0; 2 1.4,0
PANASONIC_D = smd 3 x 1.4: + 2.4,0; - -2.4,0
C225-062X268 = drill 1.016 octagon: 1 -11.303,0; 2 11.303,0
CPOL-RADIAL-100UF-25V = drill 0.7 pad 1.651 square: 1 1.27,0 | drill 0.7 pad 1.651 round: 2 -1.27,0
CPOL-RADIAL-10UF-25V = drill 0.7 pad 1.651 square: 1 1.27,0 | drill 0.7 pad 1.651 round: 2 -1.27,0
0805 = smd 0.8 x 1.2: 1 -0.9,0; 2 0.9,0
CAP-PTH-SMALL = drill 0.7 pad 1.651 round: 1 0,0; 2 2.54,0
EIA7343 = smd 2.55 x 2.7: A 3.17,0; C -3.17,0
SOD-123 = smd 1.2 x 0.7: A 1.85,0; C -1.85,0
SOT23-5 = smd 0.69 x 0.99: 1 -0.95,-1.29; 2 0,-1.29; 3 0.95,-1.29; 4 0.95,1.3; 5 -0.95,1.3
POWER_JACK_PTH = drill 2.997 round: GND 0,7.7; GNDBREAK 4.7,10.7; PWR 0,13.7
RT424 = drill 1.3 pad 2.5 round: 11 7.56,-3.78; 12 2.52,-3.78; 14 12.6,-3.78; 21 7.56,3.78; 22 2.52,3.78; 24 12.6,3.78 | drill 1.3 round: A1 -12.6,-3.78; A2 -12.6,3.78; A3 -12.6,0
CHIPLED_1206 = smd 1.5 x 1.5: A 0,-1.75; C 0,1.75
DIL6-SMD = smd 1.78 x 1.52: 1 -2.54,-4.645; 2 0,-4.645; 3 2.54,-4.645; 4 2.54,4.645; 5 0,4.645; 6 -2.54,4.645
2,54/0,9 = drill 0.914 pad 2.54 octagon: 1 0,0
SOT23-BEC = smd 1 x 1.4: B -0.95,-1.1; C 0,1.1; E 0.95,-1.1
1206 = smd 1.6 x 1.8: 1 -1.4,0; 2 1.4,0
R2010 = smd 1.8 x 2.7: 1 -2.2,0; 2 2.2,0
SMD-2728 = smd 2.54 x 7.62: 1 -3.175,0; 2 2.857,0
R1206 = smd 1.6 x 1.803: 1 -1.422,0; 2 1.422,0
S20K250 = drill 1.194 long: 1 -1.524,-5.08; 2 1.524,5.08
DIP-14-SMD = smd 1.067 x 2.54: P$1 -7.62,-7.62; P$2 -5.08,-7.62; P$3 -2.54,-7.62; P$5 2.54,-7.62; P$6 5.08,-7.62; P$7 7.62,-7.62; P$8 7.62,7.62; P$9 5.08,7.62; P$10 2.54,7.62; P$12 -2.54,7.62; P$13 -5.08,7.62; P$14 -7.62,7.62
RJ45-8 = drill 1 pad 1.88 square: 1 -4.445,6.35 | drill 1 pad 1.88 round: 2 -3.175,8.89; 3 -1.905,6.35; 4 -0.635,8.89; 5 0.635,6.35; 6 1.905,8.89; 7 3.175,6.35; 8 4.445,8.89 | hole 3.2: -5.715,0; 5.715,0
W237-102 = drill 1.194 long: 1 -2.5,-1.27; 2 2.5,-1.27
HC49/S = drill 0.813 round: 1 -2.413,0; 2 2.413,0
1812 = smd 1.6 x 3: 1 -2.3,0; 2 2.3,0
1806 = smd 1.5 x 1.2: 1 -2.3,0; 2 2.2,0

### Placement (x,y rotation side)
ADE1  43.94,21.84 90 top
ADE2  71.88,21.84 90 top
C1  37.59,12.95 270 top
C2  32,11.68 90 top
C3  44.96,8.64 270 top
C4  48.26,8.64 270 top
C5  38.86,29.46 90 top
C6  42.67,29.46 90 top
C7  64.26,59.11 90 top
C8  52.83,14.22 0 top
C9  52.83,21.84 0 top
C10  9.65,23.27 270 top
C11  42.16,46.1 0 top
C12  42.16,52.83 0 top
C13  36.96,23.29 90 top
C14  38.51,24.16 90 top
C15  43.43,56.9 180 top
C16  70.61,29.46 90 top
C17  52.83,24.38 0 top
C18  66.8,29.46 90 top
C19  46.48,29.46 90 top
C20  65.53,12.95 270 top
C21  72.9,8.64 270 top
C22  76.2,8.64 270 top
C23  59.94,11.68 90 top
C24  64.9,23.22 90 top
C25  66.4,24.08 90 top
C26  80.77,21.84 0 top
C27  80.77,14.22 0 top
C28  80.77,26.92 0 top
C29  74.42,29.46 90 top
C30  49.53,63.17 90 top
C31  16.51,26.53 270 top
C32  8.64,75.69 180 top
C33  9.91,49.02 180 top
D1  53.85,63.25 270 top
D3  68.58,59.44 270 top
D4  71.88,59.44 270 top
D5  57.15,63.25 270 top
IC1  84.58,9.14 180 top
J1  -1.02,87.88 270 top
K1  54.86,81.53 90 top
K2  70.87,77.72 90 top
LED1  12.95,43.69 270 top
OK1  122.43,39.12 270 top
OK2  99.82,29.72 90 top
OK3  99.82,39.12 90 top
OK4  99.82,10.92 90 top
OK5  122.43,10.92 270 top
OK6  99.82,48.51 270 top
OK7  122.43,20.32 270 top
OK8  99.82,20.32 90 top
OK9  122.43,29.72 270 top
PAD1  12.45,7.11 90 top
PAD2  17.53,7.11 90 top
Q1  67.06,53.59 0 top
Q2  73.41,53.59 0 top
Q3  52.32,57.4 0 top
Q4  58.67,57.4 0 top
R1  51.56,29.46 180 top
R2  46.74,37.34 180 top
R3  39.12,37.34 180 top
R4  52.83,26.92 180 top
R5  52.83,19.3 0 top
R6  52.83,16.76 0 top
R7  31.5,37.34 180 top
R8  85.09,74.93 90 top
R9  91.19,51.05 0 top
R10  20.07,80.01 270 top
R11  41.4,12.95 90 top
R12  35.31,64.01 90 top
R13  52.32,52.58 180 top
R14  35.56,70.61 90 top
R15  7.37,43.69 0 top
R16  69.34,12.95 90 top
R17  79.5,29.46 180 top
R18  74.68,37.34 180 top
R20  80.77,24.38 180 top
R21  80.77,19.3 0 top
R22  80.77,16.76 0 top
R23  67.06,37.34 180 top
R24  59.44,37.34 180 top
R25  99.06,74.93 90 top
R26  107.44,9.91 270 top
R27  91.19,13.46 0 top
R28  107.44,28.7 270 top
R29  107.44,38.1 270 top
R30  91.19,41.66 0 top
R31  91.19,32.26 0 top
R32  107.44,19.3 270 top
R35  91.19,22.86 0 top
R36  67.06,48.77 180 top
R37  67.06,46.23 0 top
R38  73.41,48.77 180 top
R39  73.41,46.23 0 top
R40  114.3,20.32 270 top
R41  114.3,30.23 90 top
R42  52.32,50.04 0 top
R43  58.67,52.58 180 top
R44  58.67,50.04 0 top
R45  114.3,12.19 270 top
R46  114.3,39.12 90 top
U$5  13.46,62.23 270 top
U$6  126.75,85.09 90 top
U$7  126.75,69.6 90 top
X1  26.67,88.9 0 top
X2  83.82,88.9 0 top
X3  40.64,88.9 0 top
X4  97.79,88.9 0 top
Y1  33.78,21.84 90 top
Y2  61.72,21.84 90 top
Z1  27.43,56.64 270 top
Z2  23.75,24.89 0 top
Z3  84.07,64.77 270 top
Z4  86.11,64.77 270 top
Z6  31.5,56.64 270 top
Z7  100.08,64.77 270 top
Z8  98.04,64.77 270 top
Z9  23.75,20.32 0 top

### Tracks (layer width: path | path; a pad name or v marks a point on that pad's centre or on a via)
AGND
  Top 0.254: ADE2.10 76.58,24.77 76.71,24.64 76.71,23.62 76.56,23.47 ADE2.8 | ADE1.10 48.64,24.77 48.77,24.64 48.77,23.62 48.62,23.47 ADE1.8 | C14.2 38.51,25.81 38.61,25.91 | 64.86,24.12 C24.2
  Top 0.406: C13.2 36.96,24.89 | 36.77,24.19 36.07,24.19 | 64.86,24.12 64.11,24.12 | 64.9,24.11 C24.2 64.9,24.73
  pour Top (isolate 0.254, hatched): 80.77,51.56 82.04,52.83 96.52,52.83 96.52,6.35 95.25,5.08 25.65,5.08 24.38,6.35 24.38,32 25.65,33.27 79.5,33.27 80.77,34.54
  pour Top: 25.65,5.08 24.38,6.35 96.52,6.35 95.25,5.08
AVCC  (via drill 0.38, 0.7)
  Top 0.254: C4.1 C3.1 v44.96,12.19 44.96,19.3 45.22,19.57 ADE1.2 | C22.1 C21.1 v72.9,12.19 72.9,18.8 73.66,19.56 75.5,19.56 ADE2.2 | v41.66,9.14 41.4,9.4 | v69.34,9.14 R16.1 | R9.1 89.79,49.15 v89.41,48.77 | v93.47,36.58 OK3.6 | v93.73,27.18 OK2.6 | R31.1 89.79,30.86 90.42,30.23 v90.68,30.23 | R35.1 89.79,21.46 90.42,20.83 v90.68,20.83 | R27.1 89.79,11.55 v89.41,11.18 | v93.73,8.38 OK4.6 | IC1.5 87.09,7.84 v87.38,8.13 | R30.1 89.79,40.26 v90.42,39.62 | 41.4,9.4 | 41.4,9.4 41.15,9.65 41.15,11.28 R11.1 | v93.47,17.27 93.98,17.78 OK8.6
  Top 0.406: R11.1
  Top 1.016: Z9.2 v28.19,20.32
  Top 1.27: R16.1 69.34,11.68
  pour Bottom (isolate 0.254, hatched): 24.38,6.35 25.65,5.08 95.25,5.08 96.52,6.35 96.52,52.83 82.04,52.83 80.77,51.56 80.77,34.54 79.5,33.27 25.65,33.27 24.38,32
  pour Bottom: 25.65,5.08 24.38,6.35 96.52,6.35 95.25,5.08
AVDD
  Top 0.254: ADE1.3 45.03,20.22 44.3,19.48 44.3,17.45 43.18,16.33 43.18,14.99 42.57,14.38 R11.2 41.38,14.35 C1.1 35.44,14.35 35.17,14.08 C2.+
AVDD1
  Top 0.254: ADE2.3 73.28,20.22 72.24,19.18 72.24,17.22 71.12,16.1 71.12,14.99 70.51,14.38 R16.2 69.34,14.35 C20.1 62.87,14.35 62.6,14.08 C23.+
CS+1
  Top 0.254: Z3.1 84.07,68.07 84.84,68.83 84.84,69.09 84.58,69.34 80.26,69.34 79.76,69.85 79.76,74.68 80.26,75.18 80.77,75.18 80.77,77.53 81.03,77.79 R8.2
  Top 1.905: 86.32,84.07 X2.2
  Top 2.54: 86.32,84.07 85.09,82.84 R8.2
CS+2
  Top 0.254: Z7.1 100.08,68.07 99.31,68.83 99.31,69.09 99.57,69.34 103.89,69.34 104.39,69.85 104.39,74.68 103.89,75.18 103.38,75.18 103.38,77.53 103.12,77.79 R25.2
  Top 1.905: 100.29,84.07 X4.2
  Top 2.54: 100.29,84.07 99.06,82.84 R25.2
CS-1-GND  (via drill 0.38)
  Top 0.254: v117.09,51.56 117.09,52.2 117.86,52.96 U$7.2 | v108.46,15.49 106.17,15.49 105.92,15.24 105.92,11.18 105.66,10.92 OK4.2
  Bottom 0.254: v108.46,15.49 115.82,15.49 117.09,16.76 v117.09,51.56
CS-1-SIG  (via drill 0.38)
  Top 0.254: v112.52,45.47 112.52,47.88 113.16,48.51 115.19,48.51 118.36,51.69 118.36,62.36 120.4,64.39 U$7.1 | R26.1 v107.44,13.72
  Bottom 0.254: v112.52,45.47 111.51,44.45 111.51,30.99 108.97,28.45 108.97,17.53 107.44,16 v107.44,13.72
CS-2-GND  (via drill 0.38)
  Top 0.254: v104.9,25.02 105.92,24 105.92,20.57 105.66,20.32 OK8.2 | v116.33,53.09 116.33,70.23 117.6,71.5 U$7.6
  Bottom 0.254: v116.33,53.09 108.58,53.09 107.44,51.94 107.44,47.12 104.9,44.58 v104.9,25.02
CS-2-SIG  (via drill 0.38)
  Top 0.254: v114.05,47.75 115.19,47.75 118.87,51.44 118.87,60.83 121.92,63.88 121.92,67.06 121.28,67.69 U$7.3 | v106.93,24.89 106.93,23.88 107.44,23.37 R32.1
  Bottom 0.254: v114.05,47.75 110.11,47.75 107.95,45.59 107.95,34.8 106.93,33.78 v106.93,24.89
CS-N-1  (via drill 0.38)
  Top 0.254: OK4.4 R27.2 92.59,12.07 91.95,11.43 v91.44,11.43 | ADE1.17 38.65,20.87 v38.35,20.57 | IC1.1 85.53,11.36 v86.36,12.19
  Bottom 0.254: v38.35,20.57 38.35,17.14 38.99,16.51 42.42,16.51 42.93,17.02 65.79,17.02 66.29,16.51 72.39,16.51 75.69,13.21 86.11,13.21 | 86.11,13.21 86.36,13.21 | 86.36,13.21 86.61,13.21 | 86.61,13.21 90.93,13.21 91.44,12.7 v91.44,11.43 | 86.36,13.21 86.36,12.95 | 86.36,12.95 v86.36,12.19 | 86.11,13.21 86.36,12.95 | 86.36,12.95 86.61,13.21
CS-N-2  (via drill 0.38)
  Top 0.254: ADE2.17 69.97,20.87 70.61,21.51 v70.61,22.1 | v86.11,22.1 86.11,23.62 87.38,24.89 92.08,24.89 92.59,24.38 R35.2 OK8.4 | v86.11,14.99 86.11,13.46 84.58,11.94 IC1.2
  Bottom 0.254: v70.61,22.1 v86.11,22.1 v86.11,14.99
GND
  pour Top (isolate 0.254, hatched): 16.51,63.5 15.24,62.23 2.79,62.23 1.27,60.71 1.27,1.52 2.79,0 130.05,0 131.32,1.27 131.32,39.62 130.05,40.89 127,40.89 125.73,39.62 125.73,5.08 124.46,3.81 24.38,3.81 23.11,5.08 23.11,40.64 24.38,41.91 77.85,41.91 78.49,42.55 78.49,67.06 64.77,67.06 59.69,72.14 29.46,72.14 21.59,80.01 17.78,80.01 16.51,78.74
  pour Top: 35.81,48.26 22.61,48.26 22.61,41.91 35.81,41.91
  pour Top (rank 2): 130.94,3.81 1.65,3.81 1.65,1.14 2.41,0.38 130.43,0.38 130.94,0.89
GND-ISO  (via drill 0.8)
  other vias: 127,68.07 127,84.33
  pour Top (isolate 0.254, hatched): 103.12,51.05 104.14,52.32 112.78,52.32 112.78,91.44 114.05,92.71 128.52,92.71 129.79,91.44 129.79,47.75 128.52,46.48 122.17,46.48 119.13,43.43 119.13,7.62 118.11,6.6 104.14,6.6 103.12,7.87
  pour Bottom (isolate 0.254, hatched): 114.05,92.71 112.78,91.44 112.78,61.98 129.79,61.98 129.79,91.44 128.52,92.71
INPUT_GND
  Top 1.016: J1.GND 6.68,86.18 J1.GNDBREAK 10.53,83.18 11.81,81.91 C32.C 11.81,72.26 9.4,69.85 U$5.P$1
INPUT_VCC
  Top 1.016: 2.79,75.69 2.79,76.45 | 2.79,76.45 2.79,89.66 5.59,92.46 10.14,92.46 12.68,89.92 J1.PWR | U$5.P$2 4.06,67.31 2.79,68.58 2.79,75.69 | 2.79,75.69 3.56,75.69 | 3.56,75.69 C32.A | 2.79,76.45 3.3,75.95 | 3.56,75.69 3.05,75.18
MISO-N  (via drill 0.38)
  Top 0.254: ADE2.19 69.79,19.57 70.43,18.92 71.12,18.92 71.88,19.68 v71.88,23.02 | ADE2.19 68.25,19.56 | v65.43,18.8 66.2,19.57 ADE2.19 | ADE1.19 42.46,19.57 v43.18,18.85 | v85.34,34.54 85.34,44.96 86.61,46.23 91.44,46.23 93.73,48.51 OK6.2
  Bottom 0.254: v71.88,23.02 72.48,23.62 83.57,23.62 85.34,25.4 v85.34,34.54 | v43.18,18.85 44.04,17.98 64.62,17.98 v65.43,18.8
MISO-N-GND  (via drill 0.38)
  Top 0.254: U$6.4 116.71,84.45 116.33,84.07 116.33,77.98 114.3,75.95 114.3,50.8 v113.79,50.29 | v108.71,50.29 107.7,50.29 105.92,48.51 OK6.5
  Bottom 0.254: v108.71,50.29 v113.79,50.29
MISO-N-SIG  (via drill 0.38)
  Top 0.254: U$6.5 121.79,85.72 122.43,85.09 122.43,76.45 123.95,74.93 123.95,61.85 121.41,59.31 v121.41,53.85 | v105.92,47.24 105.92,46.23 105.66,45.97 OK6.4
  Bottom 0.254: v105.92,47.24 106.05,47.24 106.93,48.13 106.93,52.2 108.58,53.85 v121.41,53.85
MOSI  (via drill 0.38)
  Top 0.254: v70.48,17.78 69.36,18.91 ADE2.20 67.12,18.92 66.8,18.6 v66.8,17.55 | ADE1.20 41.64,18.92 41.96,18.6 v41.96,17.55 | OK2.4 R31.2 92.59,33.66 91.95,34.29 v90.17,34.29
  Bottom 0.254: v70.48,17.78 72.14,17.78 76.2,13.72 88.14,13.72 89.15,14.73 89.15,33.27 v90.17,34.29 | v41.96,17.55 v66.8,17.55
MOSI-GND
  Top 0.254: U$6.2 117.86,78.49 114.81,75.44 114.81,49.91 114.43,49.53 110.36,49.53 108.97,48.13 108.97,35.05 105.92,32 105.92,29.97 105.66,29.72 OK2.2
MOSI-SIG  (via drill 0.38)
  Top 0.254: U$6.1 120.4,76.58 122.94,74.04 122.94,62.87 119.89,59.82 119.89,50.8 115.32,46.23 v113.79,46.23 | v108.46,32.77 107.44,31.75 R28.1
  Bottom 0.254: v113.79,46.23 109.47,46.23 108.46,45.21 v108.46,32.77
N$1  (via drill 0.38)
  Top 0.254: v84.07,60.71 Z3.2 | v57.66,29.21 57.66,27.94 57.15,27.43 57.15,18.29 56.64,17.78 56.13,17.78 55.88,17.53 55.88,17.02 55.63,16.76 R6.2
  Bottom 0.254: v84.07,60.71 84.84,59.94 84.84,37.08 82.55,34.8 82.55,31.24 81.28,29.97 60.96,29.97 59.69,28.7 58.67,28.7 58.17,29.21 v57.66,29.21
N$2  (via drill 0.38)
  Top 0.254: v27.43,51.82 Z1.2 | v27.18,37.34 R7.2
  Bottom 0.254: v27.43,51.82 27.43,49.78 25.4,47.75 21.59,47.75 9.65,35.81 C10.1 9.65,34.54 11.94,34.54 12.95,35.56 20.83,35.56 22.61,37.34 v27.18,37.34
N$3  (via drill 0.38)
  Top 0.254: R5.2 55.63,19.3 55.88,19.05 55.88,18.54 56.13,18.29 56.39,18.29 56.64,18.54 v56.64,28.19 | v86.11,60.68 Z4.2
  Bottom 0.254: v86.11,60.68 86.11,60.71 85.34,59.94 85.34,36.83 83.06,34.54 83.06,30.99 81.53,29.46 61.21,29.46 59.94,28.19 v56.64,28.19
N$4  (via drill 0.38)
  Top 0.254: v31.5,51.82 Z6.2 | v55.12,37.34 R24.2
  Bottom 0.254: C31.1 16.51,37.85 | v55.12,37.34 53.34,39.12 21.59,39.12 20.31,37.83 C31.1 | v31.5,51.82 31.5,48.01 27.94,44.45 22.1,44.45 16.51,38.86 C31.1
N$5
  Top 0.254: R7.1 R3.2
N$6
  Top 0.254: R3.1 R2.2
N$7  (via drill 0.38)
  Top 0.254: v127.08,16.26 OK7.4 | v81.28,58.17 v102.11,58.17 | v68.45,43.92 v68.46,43.92 R37.2
  Bottom 0.254: v127.08,16.26 125.09,16.26 124.46,16.89 124.46,44.07 126.49,46.1 126.49,57.28 125.6,58.17 v102.11,58.17 | v81.28,58.17 81.28,55.88 80.01,54.61 77.72,54.61 76.45,53.34 76.45,47.75 75.95,47.24 71.63,47.24 70.1,45.72 70.1,44.45 69.57,43.92 v68.45,43.92
N$8
  Top 0.254: Q4.C 58.67,64.52 58.09,65.1 D5.C 57.15,66.29 58.64,67.79 K1.A1
N$9
  Top 0.254: Y2.1 61.72,22 62.04,22.32 C24.1 64.9,21.84 65.22,21.52 ADE2.16
N$10
  Top 0.254: ADE1.16 37.27,21.52 36.96,21.84 C13.1 34.1,22.39 33.78,22.07 Y1.1
N$11
  Top 0.254: ADE1.15 38.82,22.17 38.51,22.49 C14.1 34.1,23.25 33.78,23.57 Y1.2
N$12
  Top 0.254: Y2.2 61.72,23.5 62.04,23.18 C25.1 66.4,22.49 66.71,22.17 ADE2.15
N$13  (via drill 0.38)
  Top 0.254: R22.2 83.57,16.76 83.82,17.02 83.82,17.53 84.07,17.78 v87.63,17.78 | 100.33,62.57 Z7.2 v100.08,60.71
  Bottom 0.254: v87.63,17.78 87.63,19.05 87.38,19.3 87.38,55.63 89.41,57.66 97.79,57.66 99.31,59.18 99.31,59.94 v100.08,60.71
N$14  (via drill 0.38)
  Top 0.254: R21.2 83.57,19.3 83.82,19.05 83.82,18.54 84.07,18.29 86.61,18.29 v86.87,18.54 | v98.04,60.71 Z8.2
  Bottom 0.254: v86.87,18.54 86.87,55.88 89.15,58.17 97.54,58.17 98.81,59.44 98.81,59.94 v98.04,60.71
N$15
  Top 0.254: R24.1 R23.2
N$16
  Top 0.254: R23.1 R18.2
N$17
  Top 0.254: Q2.C 73.41,60.96 73.08,61.29 D4.C 71.88,62.48 72.39,62.99 73.66,62.99 74.65,63.98 K2.A1
N$18
  Top 0.254: Q1.C 67.06,60.71 67.64,61.29 D3.C 68.58,62.48 67.09,63.98 K2.A2
N$19
  Top 0.254: R28.2 106.04,27.3 105.92,27.18 OK2.1
N$20
  Top 0.254: R9.2 OK6.1
N$21  (via drill 0.38)
  Top 0.254: v127.08,25.4 OK9.4 | v82.04,58.93 v103.12,58.93 | R39.2 v76.71,46.23
  Bottom 0.254: v127.08,25.4 125.6,25.4 124.97,26.04 124.97,43.81 127,45.85 127,57.53 125.86,58.67 103.63,58.67 103.38,58.93 v103.12,58.93 | v82.04,58.93 82.04,55.63 80.26,53.85 77.98,53.85 77.22,53.09 77.22,46.74 v76.71,46.23
N$22
  Top 0.254: Q1.B 66.11,51.12 65.66,50.67 R36.2 R37.1
N$23
  Top 0.254: Q3.C 52.32,64.52 52.9,65.1 D1.C 53.85,66.29 53.09,67.06 51.56,67.06 51.08,67.53 K1.A2
N$24
  Top 0.254: Q2.B 72.46,51.12 72.01,50.67 R38.2 R39.1
N$25
  Top 0.254: Q3.B 51.37,54.93 50.92,54.48 R13.2 R42.1
N$26
  Top 0.254: R40.1 115.45,21.72 116.59,22.86 OK7.1
N$27
  Top 0.254: Q4.B 57.72,54.93 57.27,54.48 R43.2 R44.1
N$28  (via drill 0.38)
  Top 0.254: v127.08,6.86 OK5.4 | v80.26,57.4 v103.12,57.4 | v53.85,48.01 53.72,48.13 R42.2
  Bottom 0.254: v127.08,6.86 124.59,6.86 123.95,7.49 123.95,44.32 125.98,46.35 125.98,57.02 125.35,57.66 104.39,57.66 104.14,57.4 v103.12,57.4 | v80.26,57.4 78.99,57.4 78.23,56.64 78.23,56.13 77.72,55.63 67.06,55.63 64.26,52.83 64.26,50.29 63.5,49.53 55.37,49.53 v53.85,48.01
N$29
  Top 0.254: R41.2 115.95,31.63 116.59,32.26 OK9.1
N$30  (via drill 0.38)
  Top 0.254: v127.08,35.05 OK1.4 | v79.5,56.39 103.89,56.39 104.39,56.9 v104.39,59.44 | v60.2,48.01 60.07,48.13 R44.2
  Bottom 0.254: v127.08,35.05 126.11,35.05 125.48,35.69 125.48,43.56 127.51,45.59 127.51,57.78 126.11,59.18 105.16,59.18 104.9,59.44 v104.39,59.44 | v79.5,56.39 79.5,55.63 78.99,55.12 67.31,55.12 64.77,52.58 64.77,49.78 62.99,48.01 v60.2,48.01
N$31
  Top 0.254: OK5.1 116.33,13.46 116.2,13.59 R45.1
N$32
  Top 0.254: R46.2 115.45,40.52 116.59,41.66 OK1.1
N$33
  Top 0.254: R29.2 106.04,36.7 105.92,36.58 OK3.1
N$34
  Top 0.254: R32.2 105.79,17.9 105.66,17.78 OK8.1
N$35
  Top 0.254: R26.2 105.79,8.51 105.66,8.38 OK4.1
N$36
  Top 0.406: R15.2 LED1.A
N$37
  Bottom 2.54: 67.09,80.25 74.65,80.25
N$38
  Bottom 2.54: 67.07,85.28 74.64,85.28
N$39
  Bottom 2.54: 51.05,84.05 58.64,84.05
N$40
  Bottom 2.54: 51.08,89.09 58.65,89.09
N$41
  Bottom 3.607: 29.13,82.32 29.13,83.54
N$42
  Top 3.607: 24.18,81.25 24.18,83.54
NEUTRAL  (via drill 1)
  Top 0.254: Z8.1 98.04,68.07 98.81,68.83 98.81,69.34 99.31,69.85 103.63,69.85 103.89,70.1 103.89,74.42 103.63,74.68 103.38,74.68 103.38,72.01 103.12,71.75 R25.1 | R8.1 81.03,71.75 80.77,72.01 80.77,74.68 80.52,74.68 80.26,74.42 80.26,70.1 80.52,69.85 84.84,69.85 85.34,69.34 85.34,68.83 85.35,68.83 86.11,68.07 Z4.1
  Top 1.27: R10.1 20.07,86.36 21.34,87.63 X1.1
  Top 1.778: 92.2,71.75 v92.2,71.88 92.08,71.75
  Top 1.905: 38.14,78.74 X3.1 | X1.1 24.17,80.99
  Top 2.54: 92.08,71.75 R8.1 | 92.2,71.75 R25.1
  Top 3.607: 24.17,80.99 26.42,78.74 38.1,78.74 | 38.1,78.74 38.14,78.74 45.21,78.74 46.99,76.96 59.94,76.96 62.23,74.68 v76.45,74.68 | 38.1,78.74 38.1,83.57
  Bottom 3.607: v76.45,74.68 90.68,74.68 92.2,73.15 v92.2,71.88
REF
  Top 0.254: C5.1 C6.1 42.67,26.16 44.7,24.13 47.56,24.13 ADE1.9
REF1
  Top 0.254: C18.1 C16.1 70.61,26.16 72.64,24.13 75.5,24.13 ADE2.9
RELEASE-1-SIG  (via drill 0.38)
  Top 0.254: U$6.7 122.3,88.27 122.94,87.63 122.94,76.96 124.46,75.44 124.46,61.34 122.17,59.05 122.17,52.32 115.82,45.97 v115.82,45.47 | v114.3,26.16 R41.1
  Bottom 0.254: v114.3,26.16 116.08,27.94 116.08,45.21 v115.82,45.47
RELEASE-2-SIG  (via drill 0.38)
  Top 0.254: v114.81,46.99 115.19,46.99 119.38,51.18 119.38,60.33 122.43,63.37 122.43,72.14 121.79,72.77 U$7.7 | v114.3,35.94 R46.1
  Bottom 0.254: v114.3,35.94 113.79,35.94 113.53,36.19 113.53,41.4 114.81,42.67 v114.81,46.99
RESET-N  (via drill 0.38)
  Top 0.254: ADE1.1 48.65,18.92 48.77,18.8 v48.77,16.26 | ADE2.1 75.53,18.9 76.61,18.9 76.96,18.54 v76.96,12.45 | IC1.4 82.58,7.84 81.79,8.64 v81.79,9.4
  Bottom 0.254: v48.77,16.26 65.79,16.26 66.04,16 72.14,16 75.69,12.45 v76.96,12.45 81.03,12.45 81.79,11.68 v81.79,9.4
SCLK  (via drill 0.38)
  Top 0.254: ADE2.18 70.1,20.22 70.28,20.04 v70.59,20.04 | ADE2.18 68.23,20.19 | ADE1.18 42.67,20.22 v43.03,20.57 | v65.53,20.57 65.89,20.22 ADE2.18 | OK3.4 R30.2 92.59,43.05 91.95,43.69 v90.17,43.69
  Bottom 0.254: v43.03,20.57 v65.53,20.57 | v70.59,20.04 70.61,20.04 76.43,14.22 87.88,14.22 88.65,14.99 88.65,43.05 89.28,43.69 v90.17,43.69
SCLK-GND
  Top 0.254: U$6.6 116.46,87 115.82,86.36 115.82,78.49 113.79,76.45 113.79,51.56 113.03,50.8 110.49,50.8 108.46,48.77 108.46,45.72 105.92,43.18 105.92,39.37 105.66,39.12 OK3.2
SCLK-SIG  (via drill 0.38)
  Top 0.254: U$6.3 121.28,83.19 121.92,82.55 121.92,75.95 123.44,74.42 123.44,62.36 120.65,59.56 v120.65,52.83 | v106.93,42.67 106.93,42.16 107.44,41.66 R29.1
  Bottom 0.254: v120.65,52.83 117.6,52.83 117.09,52.32 108.58,52.32 107.95,51.69 107.95,46.35 106.93,45.34 v106.93,42.67
SWITCH-1-SIG  (via drill 0.38)
  Top 0.254: U$6.8 115.95,89.53 115.32,88.9 115.32,78.99 113.28,76.96 113.28,52.32 v112.52,51.56 | v114.3,16.76 R40.2
  Bottom 0.254: v112.52,51.56 115.44,51.56 116.59,50.42 116.59,18.03 115.32,16.76 v114.3,16.76
SWITCH-2-SIG  (via drill 0.38)
  Top 0.254: U$7.8 116.59,74.04 115.57,73.03 115.57,53.59 115.32,53.34 115.32,49.4 114.94,49.02 110.87,49.02 109.47,47.62 v109.47,9.65 | v114.3,8.63 R45.2
  Bottom 0.254: v109.47,9.65 110.49,8.63 v114.3,8.63
V1N
  Top 0.254: ADE1.5 49.73,21.51 50.06,21.84 C9.1 R5.1
V1N_2
  Top 0.254: R21.1 C26.1 78.21,21.84 77.88,21.51 ADE2.5
V1P
  Top 0.254: C8.1 R6.1 50.29,16.76 49.78,17.27 49.78,19.56 48.47,20.87 ADE1.4
V1P_2
  Top 0.254: ADE2.4 76.41,20.87 77.72,19.56 77.72,17.27 78.23,16.76 R22.1 C27.1
V2N
  Top 0.254: R4.2 C17.1 50.29,24.38 50.04,24.13 50.04,22.86 49.35,22.17 ADE1.6
V2N_2
  Top 0.254: C28.1 R20.2 79.37,24.25 78.36,24.25 77.98,23.88 77.98,22.86 77.29,22.17 ADE2.6
V2P
  Top 0.254: ADE1.7 47.58,22.84 48.95,22.84 49.53,23.42 49.53,25.53 48.51,26.54 47.12,26.54 46.48,27.18 C19.1 47.5,28.07 48.9,29.46 R1.2 50.16,33.57 48.94,34.8 R2.1
V2P_2
  Top 0.254: ADE2.7 76.94,22.81 77.47,23.34 77.47,25.68 76.68,26.47 75.11,26.47 74.42,27.15 C29.1 75.41,28.07 76.81,29.47 R17.2 78.1,33.57 76.88,34.8 R18.1
V-AC-IN-1
  Top 0.254: Z1.1 27.43,68.33 30.48,71.37 R14.2
  Top 2.54: K2.22 K2.12
  Bottom 0.254: R14.2 33.02,74.68 33.02,79.5 | 33.02,79.5 33.02,81.53 | 33.02,79.5 32.51,80.01 | 33.02,79.5 33.53,80.01
  Bottom 1.905: 29.17,82.3 X1.2
  Bottom 2.54: 65,80.24 K2.22
  Bottom 3.607: 29.17,82.3 29.93,81.53 33.02,81.53 42.16,81.53 44.96,78.74 63.5,78.74 65,80.24
V-AC-IN-2
  Top 0.254: Z6.1 31.5,60.71 30.23,61.98 R12.2
  Top 2.54: K1.22 K1.12
  Bottom 0.254: R12.2 26.67,69.09 26.67,78.99 24.38,81.28 21.34,81.28 19.05,83.57 19.05,90.68 22.35,93.98 39.37,93.98 43.14,90.21 X3.2
  Bottom 1.905: X3.2 43.94,87.63
  Bottom 2.54: 48.79,84.05 K1.22
  Bottom 3.607: 48.79,84.05 45.21,87.63 43.94,87.63
V-AC-OUT-1
  Top 2.54: K2.21 K2.11
  Bottom 1.905: 80.52,87.63 X2.1
  Bottom 2.54: K2.11 76.9,85.28
  Bottom 3.607: 76.9,85.28 79.25,87.63 80.52,87.63
V-AC-OUT-2
  Top 2.54: K1.21 K1.11
  Bottom 1.905: 94.49,87.63 X4.1
  Bottom 2.54: K1.11 60.9,89.09
  Bottom 3.607: 94.49,87.63 92.96,87.63 91.69,88.9 91.69,92.46 89.92,94.23 64.01,94.23 62.74,92.96 62.74,90.93 60.9,89.09
VCC  (via drill 0.38, 0.7)
  Top 0.254: OK9.6 128.78,32.26 v129.03,32.51 | OK7.6 128.52,22.86 v129.03,23.37 | OK5.6 128.78,13.46 v129.03,13.21 | R38.1 74.81,50.67 v74.68,50.8 74.36,51.12 Q2.E | Q1.E 68.01,51.12 v68.33,50.8 68.46,50.67 R36.1 | R43.1 60.07,54.48 v59.69,54.86 59.62,54.93 Q4.E | R13.1 53.72,54.48 v53.34,54.86 53.27,54.93 Q3.E | C7.1 v64.26,55.88 | v49.53,59.94 C30.1 | OK1.6 128.02,41.66 v129.03,40.64
  Top 0.406: R15.1 5.94,45.82 6.74,46.61 C33.A
  Top 1.016: v9.4,54.86 9.14,54.61 U$5.P$7 3.68,54.61 3.05,53.98 3.05,49.66 3.68,49.02 C33.A | v19.3,20.32 Z9.1
  pour Bottom (isolate 0.254, hatched): 16.51,63.5 15.24,62.23 2.79,62.23 1.27,60.71 1.27,1.52 2.79,0 130.05,0 131.32,1.27 131.32,41.91 130.05,43.18 127,43.18 125.73,41.91 125.73,5.08 124.46,3.81 24.38,3.81 23.11,5.08 23.11,40.64 24.38,41.91 77.85,41.91 78.49,42.55 78.49,67.06 64.77,67.06 59.69,72.14 29.46,72.14 21.59,80.01 17.78,80.01 16.51,78.74
  pour Bottom (rank 2): 23.62,55.12 34.8,55.12 34.8,60.71 23.62,60.71
  pour Bottom (rank 2): 130.43,0.38 2.41,0.38 1.65,1.14 1.65,3.81 130.94,3.81 130.94,0.89
VCC-ISO  (via drill 0.38)
  Top 0.254: OK6.6 105.41,51.05 106.68,52.32 111,52.32 112.52,53.85 v112.52,68.83
  Bottom 0.254: v112.52,68.83 112.52,68.96 113.79,70.23 U$7.5

### Text on the board
Bottom: 01/18/2012
tPlace: +++ | +++ | +++ | +++ | Neutral | Hot | Neutral | Hot | Hot | Neutral | Hot | Neutral | INPUT 1 | INPUT 2 | OUTPUT 1 | OUTPUT 2 | Port A | Port B | - | + | GND | +5V | 1x Meter Board v0.5 | Madduri & Rosa | TIER/UCB
tNames: .1uF | 10uF | 100uF | 1 | 1 | VCC | GND
_tsilk: 10uF | C2 | Neutral | + | C1 | C4 | C3 | 100uF | C11 | R11 | VAC | R19 | - | C12 | C8 | Y1 | ADE7753 | Z3 | R6 | C9 | C13 | 1 | PWR_INPUT | CSA-1V | Z4 | R5 | C17 | R3 | R4 | C14 | C19 | C6 | C15 | R1 | C7 | R2 | C5 | .1uF | C10 | K2 | MISO | VCC | VAC | INTERFACE | SCLK | DGND | D1 | CS | AGND | PWR_OUT | SWITCH | MOSI | VAC-Out | PAD2 | PAD1 | Neutral | VAC-Out | DGND | VCC
_bsilk: 1 | FERRITE-DIGIKEY:240-2567-1-ND
201bmp: C:/Documents and Settings/javirosa/Desktop/PCB Logos/SmallLogo-TIER.bmp
Comments: The 4 Optos on the right are for switching.